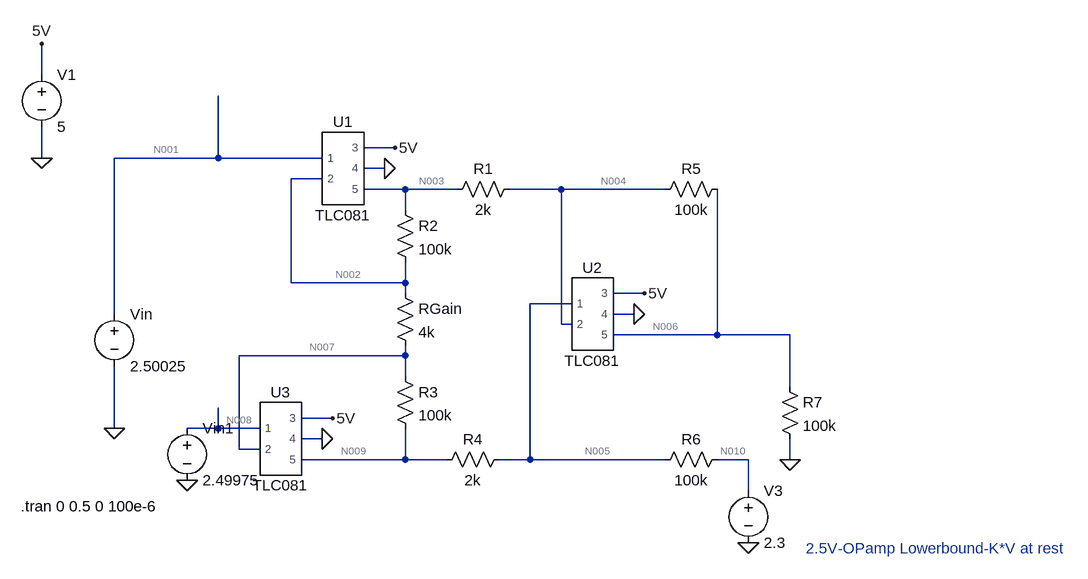
[diagram p0: schematic 3op-in solution.asc]
3op-in solution.asc, the LTspice schematic file:
Version 4
SHEET 1 2180 696
WIRE -176 -48 -176 -96
WIRE 368 64 320 64
WIRE -176 80 -176 32
WIRE 96 80 96 -16
WIRE 96 80 -64 80
WIRE 256 80 96 80
WIRE 352 96 320 96
WIRE 256 112 208 112
WIRE 384 128 320 128
WIRE 464 128 384 128
WIRE 624 128 544 128
WIRE 784 128 624 128
WIRE 384 160 384 128
WIRE 208 272 208 112
WIRE 384 272 384 240
WIRE 384 272 208 272
WIRE 384 288 384 272
WIRE 752 288 704 288
WIRE 640 304 576 304
WIRE -64 320 -64 80
WIRE 736 320 704 320
WIRE 624 336 624 128
WIRE 640 336 624 336
WIRE 864 352 864 128
WIRE 864 352 704 352
WIRE 976 352 864 352
WIRE 384 384 384 368
WIRE 384 384 128 384
WIRE 384 416 384 384
WIRE 976 432 976 352
WIRE 272 480 224 480
WIRE -64 496 -64 400
WIRE 96 496 96 464
WIRE 96 496 48 496
WIRE 160 496 96 496
WIRE 256 512 224 512
WIRE 128 528 128 384
WIRE 160 528 128 528
WIRE 384 544 384 496
WIRE 384 544 224 544
WIRE 448 544 384 544
WIRE 576 544 576 304
WIRE 576 544 528 544
WIRE 784 544 576 544
WIRE 912 544 864 544
WIRE 976 544 976 512
WIRE 912 592 912 544
FLAG -176 80 0
FLAG 352 96 0
FLAG -176 -96 5V
FLAG 368 64 5V
FLAG 256 512 0
FLAG 272 480 5V
FLAG 736 320 0
FLAG 752 288 5V
FLAG -64 496 0
FLAG 912 672 0
FLAG 976 544 0
FLAG 48 576 0
SYMBOL voltage -176 -64 R0
WINDOW 123 0 0 Left 0
WINDOW 39 0 0 Left 0
SYMATTR InstName V1
SYMATTR Value 5
SYMBOL res 368 272 R0
SYMATTR InstName RGain
SYMATTR Value 4k
SYMBOL res 560 112 R90
WINDOW 0 0 56 VBottom 2
WINDOW 3 32 56 VTop 2
SYMATTR InstName R1
SYMATTR Value 2k
SYMBOL res 368 144 R0
SYMATTR InstName R2
SYMATTR Value 100k
SYMBOL res 368 400 R0
SYMATTR InstName R3
SYMATTR Value 100k
SYMBOL res 544 528 R90
WINDOW 0 0 56 VBottom 2
WINDOW 3 32 56 VTop 2
SYMATTR InstName R4
SYMATTR Value 2k
SYMBOL res 880 112 R90
WINDOW 0 0 56 VBottom 2
WINDOW 3 32 56 VTop 2
SYMATTR InstName R5
SYMATTR Value 100k
SYMBOL res 880 528 R90
WINDOW 0 0 56 VBottom 2
WINDOW 3 32 56 VTop 2
SYMATTR InstName R6
SYMATTR Value 100k
SYMBOL voltage -64 304 R0
WINDOW 123 0 0 Left 0
WINDOW 39 0 0 Left 0
SYMATTR InstName Vin
SYMATTR Value 2.50025
SYMBOL res 960 416 R0
SYMATTR InstName R7
SYMATTR Value 100k
SYMBOL TLC081 288 96 R0
SYMATTR InstName U1
SYMBOL TLC081 672 320 R0
SYMATTR InstName U2
SYMBOL TLC081 192 512 R0
SYMATTR InstName U3
SYMBOL voltage 912 576 R0
WINDOW 123 0 0 Left 0
WINDOW 39 0 0 Left 0
SYMATTR InstName V3
SYMATTR Value 2.3
SYMBOL voltage 48 480 R0
WINDOW 123 0 0 Left 0
WINDOW 39 0 0 Left 0
SYMATTR InstName Vin1
SYMATTR Value 2.49975
TEXT -208 616 Left 2 !.tran 0 0.5 0 100e-6
TEXT 1000 680 Left 2 ;2.5V-OPamp Lowerbound-K*V at rest

The netlist it stands for:
* 3op-in solution.asc
V1 5V 0 5
RGain N002 N007 4k
R1 N004 N003 2k
R2 N003 N002 100k
R3 N007 N009 100k
R4 N005 N009 2k
R5 N006 N004 100k
R6 N010 N005 100k
Vin N001 0 2.50025
R7 N006 0 100k
XU1 N001 N002 5V 0 N003 TLC081  ; pins 1 2 3 4 5
XU2 N005 N004 5V 0 N006 TLC081  ; pins 1 2 3 4 5
XU3 N008 N007 5V 0 N009 TLC081  ; pins 1 2 3 4 5
V3 N010 0 2.3
Vin1 N008 0 2.49975
.tran 0 0.5 0 100e-6
* 2.5V-OPamp Lowerbound-K*V at rest
.lib D:\Jacob Mander\Documents\uni\Year 4\Capstone\capstone-project-team_05\project\Hardware\Simulations\lib\sloc049\TLC081.mod
.backanno
.end

* Results of the author's LTspice run, read from the files saved beside the schematic
* Operating Point, zero values left out:
*   V(5v) = 5 V
*   V(n002) = 2.501 V
*   V(n007) = 2.5 V
*   V(n004) = 2.485 V
*   V(n003) = 2.513 V
*   V(n009) = 2.488 V
*   V(n005) = 2.484 V
*   V(n006) = 1.061 V
*   V(n010) = 2.3 V
*   V(n001) = 2.5 V
*   V(n008) = 2.5 V
*   I(Rgain) = 124.8 nA
*   I(R1) = -14.24 µA
*   I(R2) = 124.9 nA
*   I(R3) = 124.8 nA
*   I(R4) = -1.842 µA
*   I(R5) = -14.24 µA
*   I(R6) = -1.842 µA
*   I(R7) = 10.61 µA
*   I(V1) = -2.867 mA
*   I(Vin) = -3.131 pA
*   I(V3) = 1.842 µA
*   I(Vin1) = -3.131 pA
*   Ix(u1:1) = 3.131 pA
*   Ix(u1:2) = 3.133 pA
*   Ix(u1:3) = 955.7 µA
*   Ix(u1:4) = -956.2 µA
*   Ix(u1:5) = -14.36 µA
*   Ix(u2:1) = 3.115 pA
*   Ix(u2:2) = 3.117 pA
*   Ix(u2:3) = 955.7 µA
*   Ix(u2:4) = -956.3 µA
*   Ix(u2:5) = 3.624 µA
*   Ix(u3:1) = 3.131 pA
*   Ix(u3:2) = 3.133 pA
*   Ix(u3:3) = 955.7 µA
*   Ix(u3:4) = -956.2 µA
*   Ix(u3:5) = -1.718 µA